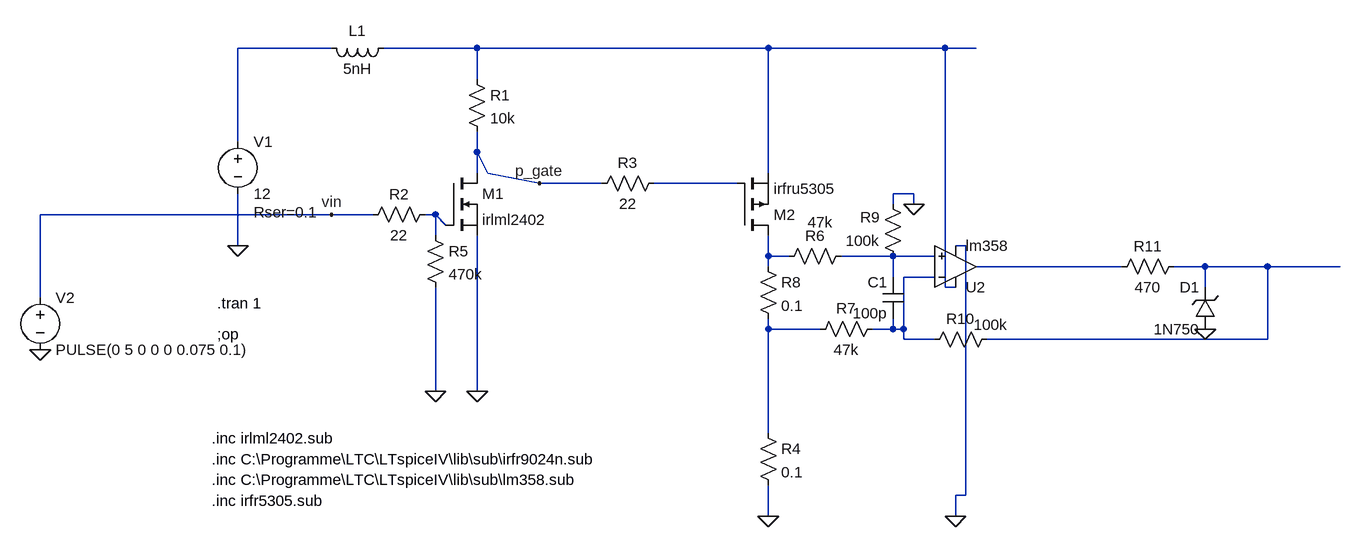
[diagram p0: schematic modell_pwm_drv2.asc]
modell_pwm_drv2.asc, the LTspice schematic file:
Version 4
SHEET 1 1880 692
WIRE 16 -48 -128 -48
WIRE 240 -48 96 -48
WIRE 688 -48 240 -48
WIRE 960 -48 688 -48
WIRE 1008 -48 960 -48
WIRE 240 0 240 -48
WIRE -128 96 -128 -48
WIRE 240 112 240 80
WIRE 240 144 240 112
WIRE 256 144 240 112
WIRE 688 144 688 -48
WIRE 336 160 256 144
WIRE 432 160 336 160
WIRE 640 160 512 160
WIRE 912 176 880 176
WIRE 880 192 880 176
WIRE 912 192 912 176
WIRE 16 208 -432 208
WIRE 80 208 16 208
WIRE 176 208 160 208
WIRE 192 224 176 208
WIRE 176 240 176 208
WIRE -128 256 -128 176
WIRE 992 256 976 256
WIRE 688 272 688 240
WIRE 720 272 688 272
WIRE 880 272 800 272
WIRE 944 272 880 272
WIRE 688 288 688 272
WIRE 1232 288 1008 288
WIRE 1360 288 1312 288
WIRE 1456 288 1360 288
WIRE 1568 288 1456 288
WIRE 880 304 880 272
WIRE 944 304 896 304
WIRE 960 320 960 -48
WIRE 976 320 960 320
WIRE 1360 320 1360 288
WIRE -432 336 -432 208
WIRE 688 384 688 368
WIRE 768 384 688 384
WIRE 880 384 880 368
WIRE 880 384 848 384
WIRE 896 384 896 304
WIRE 896 384 880 384
WIRE 896 400 896 384
WIRE 944 400 896 400
WIRE 1456 400 1456 288
WIRE 1456 400 1024 400
WIRE 176 480 176 320
WIRE 240 480 240 240
WIRE 688 544 688 384
WIRE 992 640 992 256
WIRE 992 640 976 640
WIRE 688 672 688 624
WIRE 976 672 976 640
FLAG 240 480 0
FLAG -128 256 0
FLAG 336 160 p_gate
FLAG 688 672 0
FLAG 176 480 0
FLAG 16 208 vin
FLAG -432 416 0
FLAG 976 672 0
FLAG 912 192 0
FLAG 1360 384 0
SYMBOL nmos 192 144 R0
SYMATTR InstName M1
SYMATTR Value irlml2402
SYMATTR Prefix X
SYMBOL res 224 -16 R0
SYMATTR InstName R1
SYMATTR Value 10k
SYMBOL voltage -128 80 R0
WINDOW 123 0 0 Left 2
WINDOW 39 24 124 Left 2
SYMATTR SpiceLine Rser=0.1
SYMATTR InstName V1
SYMATTR Value 12
SYMBOL res 176 192 R90
WINDOW 0 0 56 VBottom 2
WINDOW 3 32 56 VTop 2
SYMATTR InstName R2
SYMATTR Value 22
SYMBOL voltage -432 320 R0
WINDOW 123 0 0 Left 2
WINDOW 39 0 0 Left 2
SYMATTR InstName V2
SYMATTR Value PULSE(0 5 0 0 0 0.075 0.1)
SYMBOL res 672 528 R0
SYMATTR InstName R4
SYMATTR Value 0.1
SYMBOL pmos 640 240 M180
SYMATTR InstName M2
SYMATTR Value irfru5305
SYMATTR Prefix X
SYMBOL res 160 224 R0
SYMATTR InstName R5
SYMATTR Value 470k
SYMBOL res 528 144 R90
WINDOW 0 0 56 VBottom 2
WINDOW 3 32 56 VTop 2
SYMATTR InstName R3
SYMATTR Value 22
SYMBOL res 672 272 R0
SYMATTR InstName R8
SYMATTR Value 0.1
SYMBOL ind 112 -64 R90
WINDOW 0 5 56 VBottom 2
WINDOW 3 32 56 VTop 2
SYMATTR InstName L1
SYMATTR Value 5nH
SYMBOL Opamps\\opamp2 976 352 M180
SYMATTR InstName U2
SYMATTR Value lm358
SYMBOL res 816 256 R90
WINDOW 0 0 56 VBottom 2
WINDOW 3 -52 48 VTop 2
SYMATTR InstName R6
SYMATTR Value 47k
SYMBOL res 864 368 R90
WINDOW 0 0 56 VBottom 2
WINDOW 3 32 56 VTop 2
SYMATTR InstName R7
SYMATTR Value 47k
SYMBOL res 896 288 R180
WINDOW 0 36 76 Left 2
WINDOW 3 36 40 Left 2
SYMATTR InstName R9
SYMATTR Value 100k
SYMBOL res 1040 384 R90
WINDOW 0 0 56 VBottom 2
WINDOW 3 -22 10 VTop 2
SYMATTR InstName R10
SYMATTR Value 100k
SYMBOL res 1328 272 R90
WINDOW 0 0 56 VBottom 2
WINDOW 3 32 56 VTop 2
SYMATTR InstName R11
SYMATTR Value 470
SYMBOL zener 1376 384 R180
WINDOW 0 24 64 Left 2
WINDOW 3 24 0 Left 2
SYMATTR InstName D1
SYMATTR Value 1N750
SYMBOL cap 896 368 R180
WINDOW 0 24 56 Left 2
WINDOW 3 24 8 Left 2
SYMATTR InstName C1
SYMATTR Value 100p
TEXT -168 552 Left 2 !.inc irlml2402.sub
TEXT -168 584 Left 2 !.inc C:\\Programme\\LTC\\LTspiceIV\\lib\\sub\\irfr9024n.sub
TEXT -160 392 Left 2 !;op
TEXT -168 616 Left 2 !.inc C:\\Programme\\LTC\\LTspiceIV\\lib\\sub\\lm358.sub
TEXT -160 344 Left 2 !.tran 1
TEXT -168 648 Left 2 !.inc irfr5305.sub

The netlist it stands for:
* modell_pwm_drv2.asc
XM1 p_gate N004 0 irlml2402  ; pins D G S
R1 N002 p_gate 10k
V1 N001 0 12 Rser=0.1
R2 N004 vin 22
V2 vin 0 PULSE(0 5 0 0 0 0.075 0.1)
R4 N010 0 0.1
XM2 N005 N003 N002 irfru5305  ; pins D G S
R5 N004 0 470k
R3 N003 p_gate 22
R8 N005 N010 0.1
L1 N002 N001 5nH
XU2 N006 N009 N002 0 N007 lm358  ; pins In+ In- V+ V- OUT
R6 N006 N005 47k
R7 N009 N010 47k
R9 N006 0 100k
R10 N008 N009 100k
R11 N008 N007 470
D1 0 N008 1N750
C1 N009 N006 100p
.model D D
.lib standard.dio
.inc irlml2402.sub
.inc C:\Programme\LTC\LTspiceIV\lib\sub\irfr9024n.sub
;op
.inc C:\Programme\LTC\LTspiceIV\lib\sub\lm358.sub
.tran 1
.inc irfr5305.sub
.backanno
.end